# Altium schematic sheet SLAAVE.SchDoc
size A4; SheetNumber: 1; SheetTotal: 1
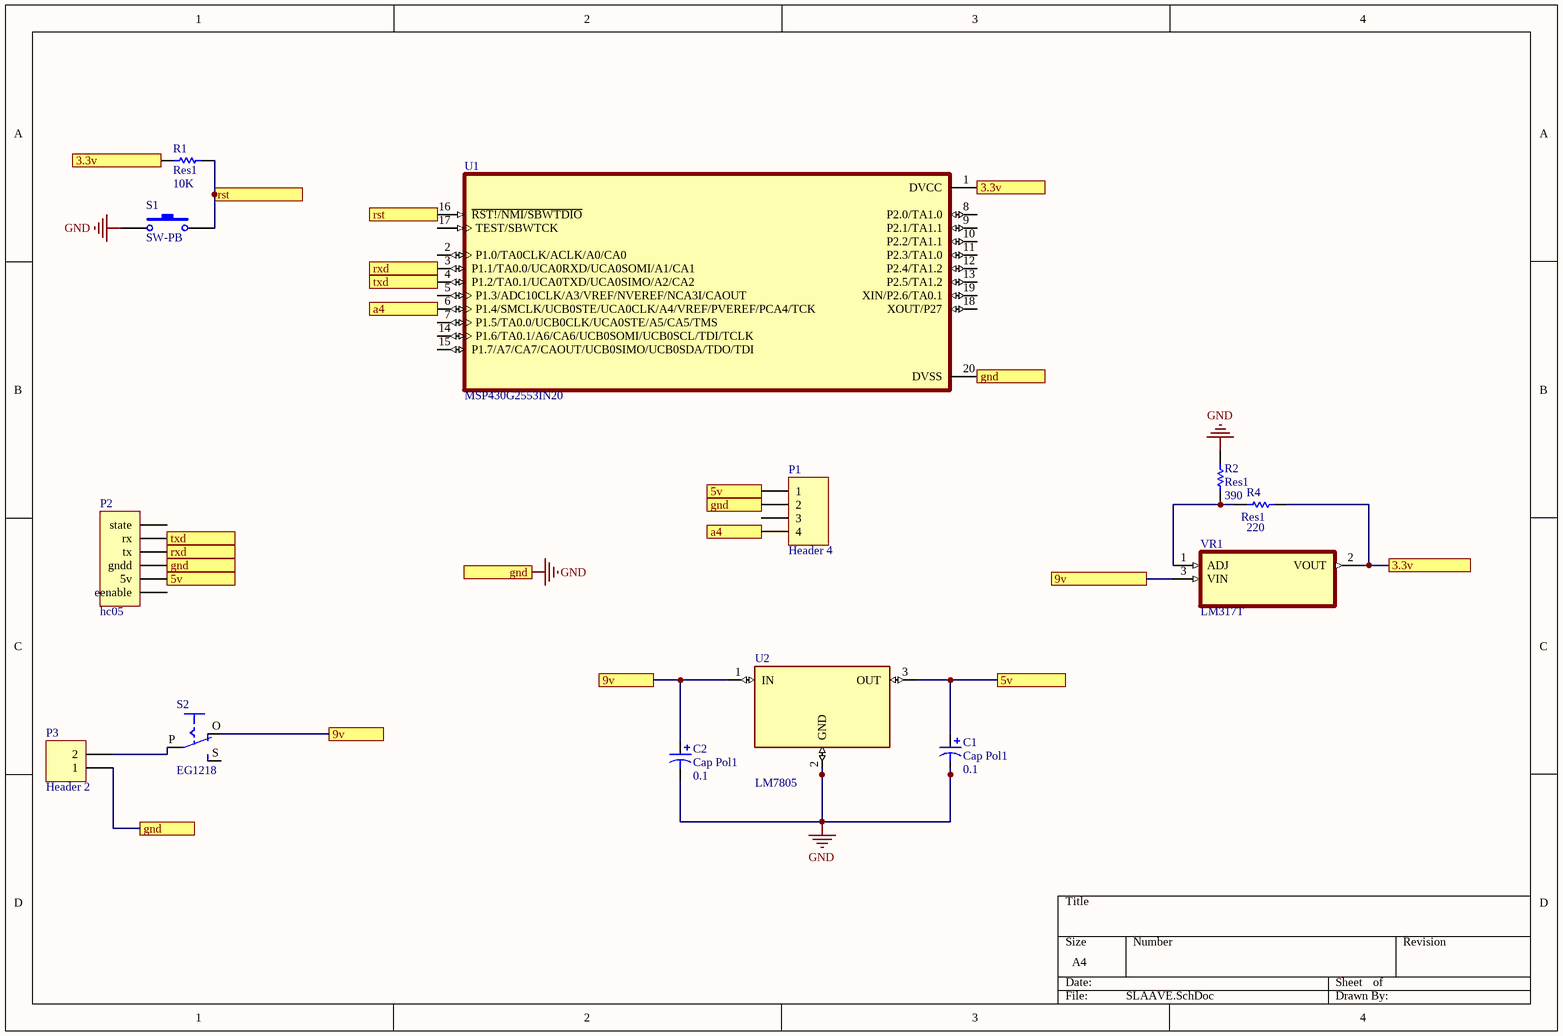
[diagram p0: SLAAVE.SchDoc]

## Parts
C1  Cap Pol1  value 0.1  [RB7.6-15]
C2  Cap Pol1  value 0.1  [RB7.6-15]
P1  Header 4  [HDR1X4]
P2  hc05  [HDR1X6]
P3  Header 2  [HDR1X2]
R1  Res1  value 10K  [AXIAL-0.3]
R2  Res1  value 390  [AXIAL-0.3]
R4  Res1  value 220  [AXIAL-0.3]
S1  SW-PB  [SPST-2]
S2  EG1218  [EG1218]
U1  MSP430G2553IN20  [DIP794W45P254L2692H508Q20]
U2  LM7805  [TO220]
VR1  LM317T  [TO254P1054X470X1955-3]

## Ports
3.3v, 5v, 9v, a4, gnd, rst, rxd, txd

## Nets
GND: C1.2 C2.2 P1.2 P2.3(gndd) P3.1 R2.2 S1.1 U1.20(DVSS) U2.2(GND) ; port gnd
3.3v: R1.1 R4.2 U1.1(DVCC) VR1.2(VOUT) ; port 3.3v
5v: C1.1 P1.1 P2.2(5v) U2.3(OUT) ; port 5v
9v: C2.1 S2.O U2.1(IN) VR1.3(VIN) ; port 9v
a4: P1.4 U1.6(P1.4/SMCLK/UCB0STE/UCA0CLK/A4/VREF/PVEREF/PCA4/TCK) ; port a4
rst: R1.2 S1.2 U1.16(~{RST!/NMI/SBWTDIO}) ; port rst
rxd: P2.4(tx) U1.3(P1.1/TA0.0/UCA0RXD/UCA0SOMI/A1/CA1) ; port rxd
txd: P2.5(rx) U1.4(P1.2/TA0.1/UCA0TXD/UCA0SIMO/A2/CA2) ; port txd
NetP3_2: P3.2 S2.P
NetR2_1: R2.1 R4.1 VR1.1(ADJ)

Not connected (* = marked no-connect by the designer): P1 3; P2 1(eenable) 6(state); S2 S; U1 2(P1.0/TA0CLK/ACLK/A0/CA0) 5(P1.3/ADC10CLK/A3/VREF/NVEREF/NCA3I/CAOUT) 7(P1.5/TA0.0/UCB0CLK/UCA0STE/A5/CA5/TMS) 8(P2.0/TA1.0) 9(P2.1/TA1.1) 10(P2.2/TA1.1) 11(P2.3/TA1.0) 12(P2.4/TA1.2) 13(P2.5/TA1.2) 14(P1.6/TA0.1/A6/CA6/UCB0SOMI/UCB0SCL/TDI/TCLK) 15(P1.7/A7/CA7/CAOUT/UCB0SIMO/UCB0SDA/TDO/TDI) 17(TEST/SBWTCK) 18(XOUT/P27) 19(XIN/P2.6/TA0.1)

## Library data of the parts
C1 C2 = Cap Pol1: Polarized Capacitor (Radial); Published: 8-Jun-2000; LatestRevisionDate: 17-Jul-2002; LatestRevisionNote: Re-released for DXP Platform.; PackageReference: RB7.6-15; Publisher: Altium Limited; PackageDescription: Polarized Capacitor (Radial); 2 Leads
P1 = Header 4: Header, 4-Pin; LatestRevisionDate: 17-Jul-2002; LatestRevisionNote: Re-released for DXP Platform.; Publisher: Altium Limited
P2 = Header 6: Header, 6-Pin; LatestRevisionDate: 17-Jul-2002; LatestRevisionNote: Re-released for DXP Platform.; Publisher: Altium Limited
P3 = Header 2: Header, 2-Pin; LatestRevisionDate: 17-Jul-2002; LatestRevisionNote: Re-released for DXP Platform.; Publisher: Altium Limited
R1 R2 R4 = Res1: Resistor; Published: 8-Jun-2000; LatestRevisionDate: 17-Jul-2002; LatestRevisionNote: Re-released for DXP Platform.; PackageReference: AXIAL-0.3; Publisher: Altium Limited; PackageDescription: Axial Device, Thru-Hole; 2 Leads; 0.3 in Pin Spacing
S1 = SW-PB: Switch; Published: 24-Mar-1999; LatestRevisionDate: 17-Jul-2002; LatestRevisionNote: Re-released for DXP Platform.; PackageReference: SPST-2; Publisher: Altium Limited; PackageDescription: Switch; 2 Leads
S2 = EG1218: æ»‘å‹•é–‹é—œSPDTé€šå­”; MF: E-Switch; Package: Custom package E-Switch; Price: None; MP: EG1218; Availability: Unavailable; Value: *; SnapEDA_Link: https://www.snapeda.com/parts/EG1218/E-Switch/view-part/13895/?ref=snap
U1 = MSP430G2553IN20: MSP430 MSP430G2xx Microcontroller IC 16-Bit 16MHz 16KB _16K x 8_ FLASH 20-PDIP; MF: Texas Instruments; Package: PDIP-20 Texas Instruments; Availability: Unavailable; Value: *; MP: MSP430G2553IN20; SnapEDA_Link: https://www.snapeda.com/parts/MSP430G2553IN20/Texas%20Instruments/view-part/46372/?ref=snap; Price: None
U2 = LM7805: Linear Voltage Regulator IC 1 Output 1.5A SOT-223-4; MF: Texas Instruments; Availability: Unavailable; SnapEDA_Link: https://www.snapeda.com/parts/LM7805/Texas%20Instruments/view-part/2302466/?ref=snap; MP: LM7805; Price: None; Value: *; Package: TO-220 Texas Instruments
VR1 = LM317T: 1.5-A, 40-V, adjustable linear voltage regulator 3-TO-220; MF: Texas Instruments; Arrow_Electronics-Purchase-URL: https://snapeda.com/shop?store=Arrow+Electronics&id=2756289; Price: None; Value: *; Availability: Unavailable; DigiKey-Purchase-URL: https://snapeda.com/shop?store=DigiKey&id=2756289; Mouser-Purchase-URL: https://snapeda.com/shop?store=Mouser&id=2756289; SnapEDA_Link: https://www.snapeda.com/parts/LM317T/Texas%20Instruments/view-part/2756289/?ref=snap; MP: LM317T; Package: TO-220-3 Texas Instruments